# EAGLE design automatic temp control (EAGLE 9.6.2)
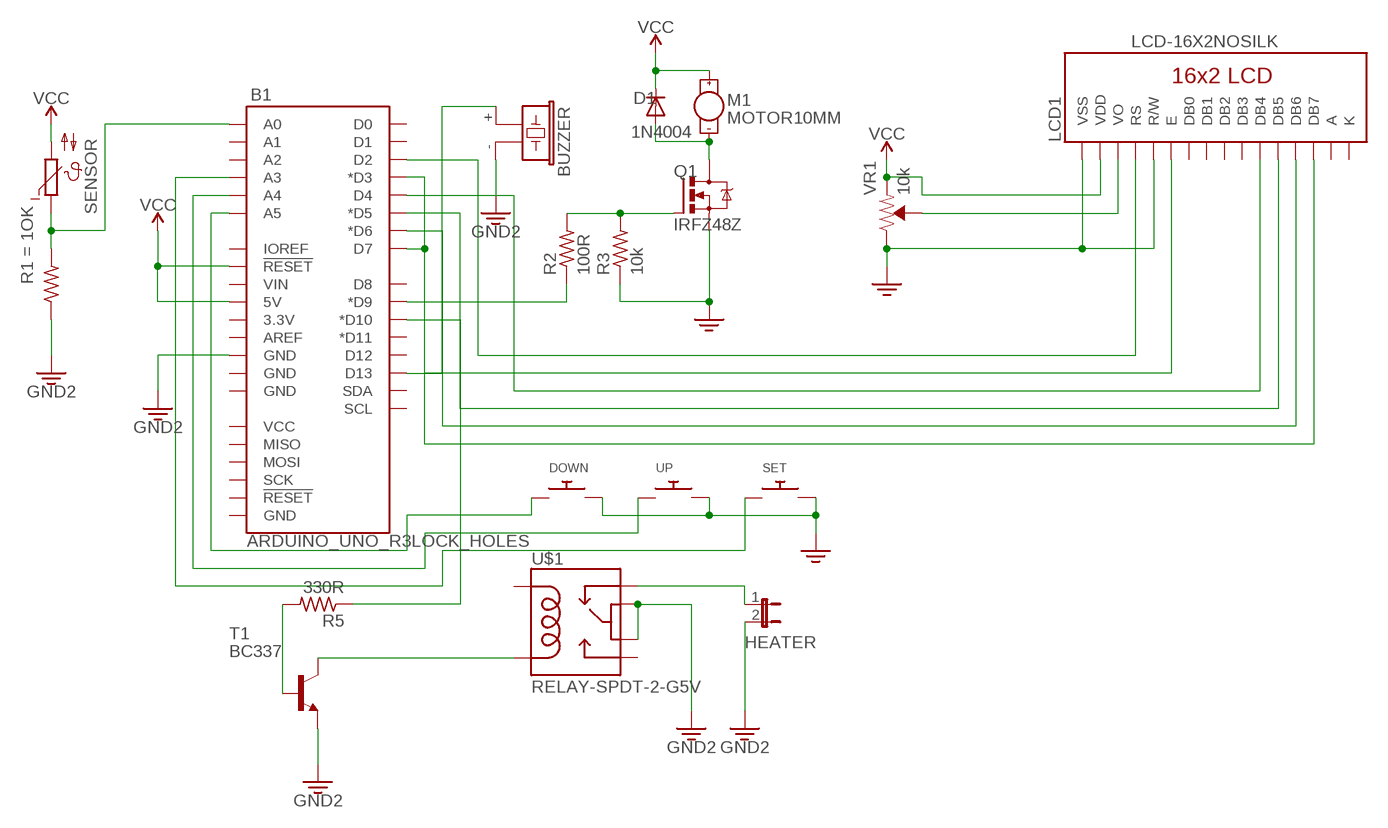
[diagram p0: schematic, sheet 1]

## Parts
B1  ARDUINO_UNO_R3LOCK_HOLES  [ARDUINO_R3_LOCK_HOLES]
BUZZER  F/CM04P  [F/CM04P]
D1  1N4004  [DO41-10]
DOWN  SWITCH_PUSHBUTTONEVQ-PE  [TACT_PANA-EVQ]
HEATER  JP1E  [JP1]
LCD1  LCD-16X2NOSILK  [LCD-16X2_NOSILK]
M1  MOTOR10MM  [VIBE-MOTOR-10MM]
Q1  IRFZ48Z  [TO220BH]
R2  100R  R-US_0204/7  [0204/7]
R3  10k  R-US_0204/7  [0204/7]
R4  R-US_0204/7  [0204/7]
R5  330R  R-US_0204/7  [0204/7]
SENSOR  NTC640-9  [N640]
SET  SWITCH_PUSHBUTTONEVQ-PE  [TACT_PANA-EVQ]
T1  BC337  [TO92]
U$1  RELAY-SPDT-2-G5V  [RELAY-G5V]
UP  SWITCH_PUSHBUTTONEVQ-PE  [TACT_PANA-EVQ]
VR1  10k  TRIMPOT-PTH-10MM-KNOB-1/2W-10%  [TRIMPOT-PTH-3386U]

## Nets
3.3V: B1.GND@4(GND) BUZZER.- DOWN.P$2 HEATER.2 LCD1.1(VSS) LCD1.5(R/W) Q1.S R3.1 R4.1 SET.P$2 T1.1(E) U$1.5 U$1.6 UP.P$2 VR1.3(CW) ; supply symbol labelled GND2
N$1: B1.A0 R4.2 SENSOR.1
N$2: B1.D10(*D10) R5.1
N$3: R5.2 T1.2(B)
N$4: T1.3(C) U$1.9
N$5: HEATER.1 U$1.1
N$6: B1.D13 BUZZER.+
N$7: B1.D9(*D9) R2.1
N$8: Q1.G R2.2 R3.2
N$9: D1.A M1.- Q1.D
N$10: B1.A5 DOWN.P$1
N$11: B1.A4 UP.P$1
N$12: LCD1.3(VO) VR1.2(WIPER)
N$13: B1.A3 SET.P$1
N$15: B1.D4 LCD1.11(DB4)
N$16: B1.D2 LCD1.4(RS)
N$17: B1.D5(*D5) LCD1.12(DB5)
N$18: B1.D6(*D6) LCD1.13(DB6)
N$19: B1.D3(*D3) B1.D7 LCD1.6(E) LCD1.14(DB7)
VCC: B1.5V B1.RESET@1(!RESET!) D1.C LCD1.2(VDD) M1.+ SENSOR.2 VR1.1(CCW)
Unconnected: B1.3.3V B1.A1 B1.A2 B1.AREF B1.D0 B1.D1 B1.D8 B1.D11(*D11) B1.D12 B1.GND@1(GND) B1.GND@2(GND) B1.GND@3(GND) B1.IOREF B1.MISO B1.MOSI B1.RESET@2(!RESET!) B1.SCK B1.SCL B1.SDA B1.VCC B1.VIN LCD1.7(DB0) LCD1.8(DB1) LCD1.9(DB2) LCD1.10(DB3) U$1.2 U$1.10

## Power pins joined to a net without a drawn wire
A: LCD1.15(A)
K: LCD1.16(K)

## Library data of the parts
B1 = SparkFun-Boards:ARDUINO_UNO_R3: Arduino R3 Footprint with SPI header Arduino Uno R3 Compatible Footprint. Matches PCB size of the original board. SparkFun Products: SAMD21 Dev Breakout <https://www.sparkfun.com/products/13672> RedBoard <https://www.sparkfun.com/products/12757> R3 Stackable Headers <https://www.sparkfun.com/products/11417>
BUZZER = buzzer:F/CM04P: BUZZER Source: Buerklin; OC_FARNELL: unknown; OC_NEWARK: unknown
D1 = adafruit:1N4004: DIODE General purpose 1N400x type rectifier (With bigger pads) http://www.ladyada.net/library/pcb/eaglelibrary.html
DOWN SET UP = adafruit:SWITCH_PUSHBUTTON: Buttons SOFTTOUCHSMD_SJ - Soft touch temporary push button (Super Junk Akihabara) Compatible with SKPMANE010 [Mouser: 688-SKPMAN] C&K_KSS = Digikey: KSS221GLFS
HEATER = jumper:JP1E: JUMPER
LCD1 = SparkFun-Displays:LCD-16X2: Standard text-only 16x2 parallel input LCD Basic 16 character by 2 line display. Typically utilizes the extremely common HD44780 parallel interface chipset SparkFun Products: Basic 16x2 Green <https://www.sparkfun.com/products/255> Basic 8x2 Green <https://www.sparkfun.com/products/11122>; SF_ID: LCD-00255
M1 = SparkFun-Electromechanical:MOTOR: Motor (Single-Phase) Two-terminal, single-phase motors. SparkFun Products Vibration Motor <https://www.sparkfun.com/products/8449> (ROB-08449) Physical dimension and wire connections for this powerful vibration motor. Motor has a self adhesive backing.; PROD_ID: COMP-08572; SF_SKU: ROB-08449
Q1 = transistor-power:IRFZ48: N Channel HEXFET® Power MOSFET Logic Level Source: http://www.irf.com/product-info/datasheets/data/irfz48z.pdf
R2 R3 R5 = rcl:R-US_: RESISTOR, American symbol; SPICEPREFIX: R
R4 = rcl:R-US_: RESISTOR, American symbol; R1: 1OK; SPICEPREFIX: R
SENSOR = ptc-ntc:NTC640-9: PHILIPS NTC; OC_FARNELL: unknown; OC_NEWARK: unknown
T1 = transistor:BC337: NPN TRANSISTOR
U$1 = SparkFun-Retired:RELAY-SPDT-2: SPDT Relay w/ Two Common Terminals SPDT relay (COM-00100); SF_SKU: COM-00524
VR1 = SparkFun-Resistors:TRIMPOT: Trimming Potentiometer (Trimpot) Three-terminal potentiometers, with an adjustable wiper and two adjustable resistors. A pot can be used to create a configurable voltage divider, or as a variable resistor. "Trimpots" are a subset of potentiometers, usually intended for "set-and-forget" applications. They're often more delicate than standard potentiometers - rated for fewer turns. Variants PTH-KNOB - PTH Trimpot w/ finger-adjustable knob Trimpot 10K with Knob <https://www.sparkfun.com/products/9806> (COM-09806) Datasheet <http://www.sparkfun.com/datasheets/Components/General/TSR-3386.pdf> SMD-3MM-CLOSED-FRAME - SMD 3mm Square Closed-Frame Trimpot Used on e.g. EasyDriver - Stepper Motor Driver <https://www.sparkfun.com/products/12779> Datasheet <http://www.bitechnologies.com/pdfs/22.pdf> (22AR10KTR) SMD-5MM - SMD 5mm Square Closed-Frame Trimpot Used on e.g. IOIO-OTG - V2.2 <https://www.sparkfun.com/products/13613> Datasheet <http://www.vishay.com/docs/51008/ts53.pdf> (TS53YL502MR10) SMD-3MM-1/10W-25% - 3mm Square Open-Frame Trimpot Used on e.g. SparkFun Shapeoko <https://www.sparkfun.com/products/13899> Datasheet <http://www.bourns.com/docs/Product-Datasheets/TC33.pdf> (TC33X-2-103E); PROD_ID: RES-09730; SF_SKU: COM-09806

## Board
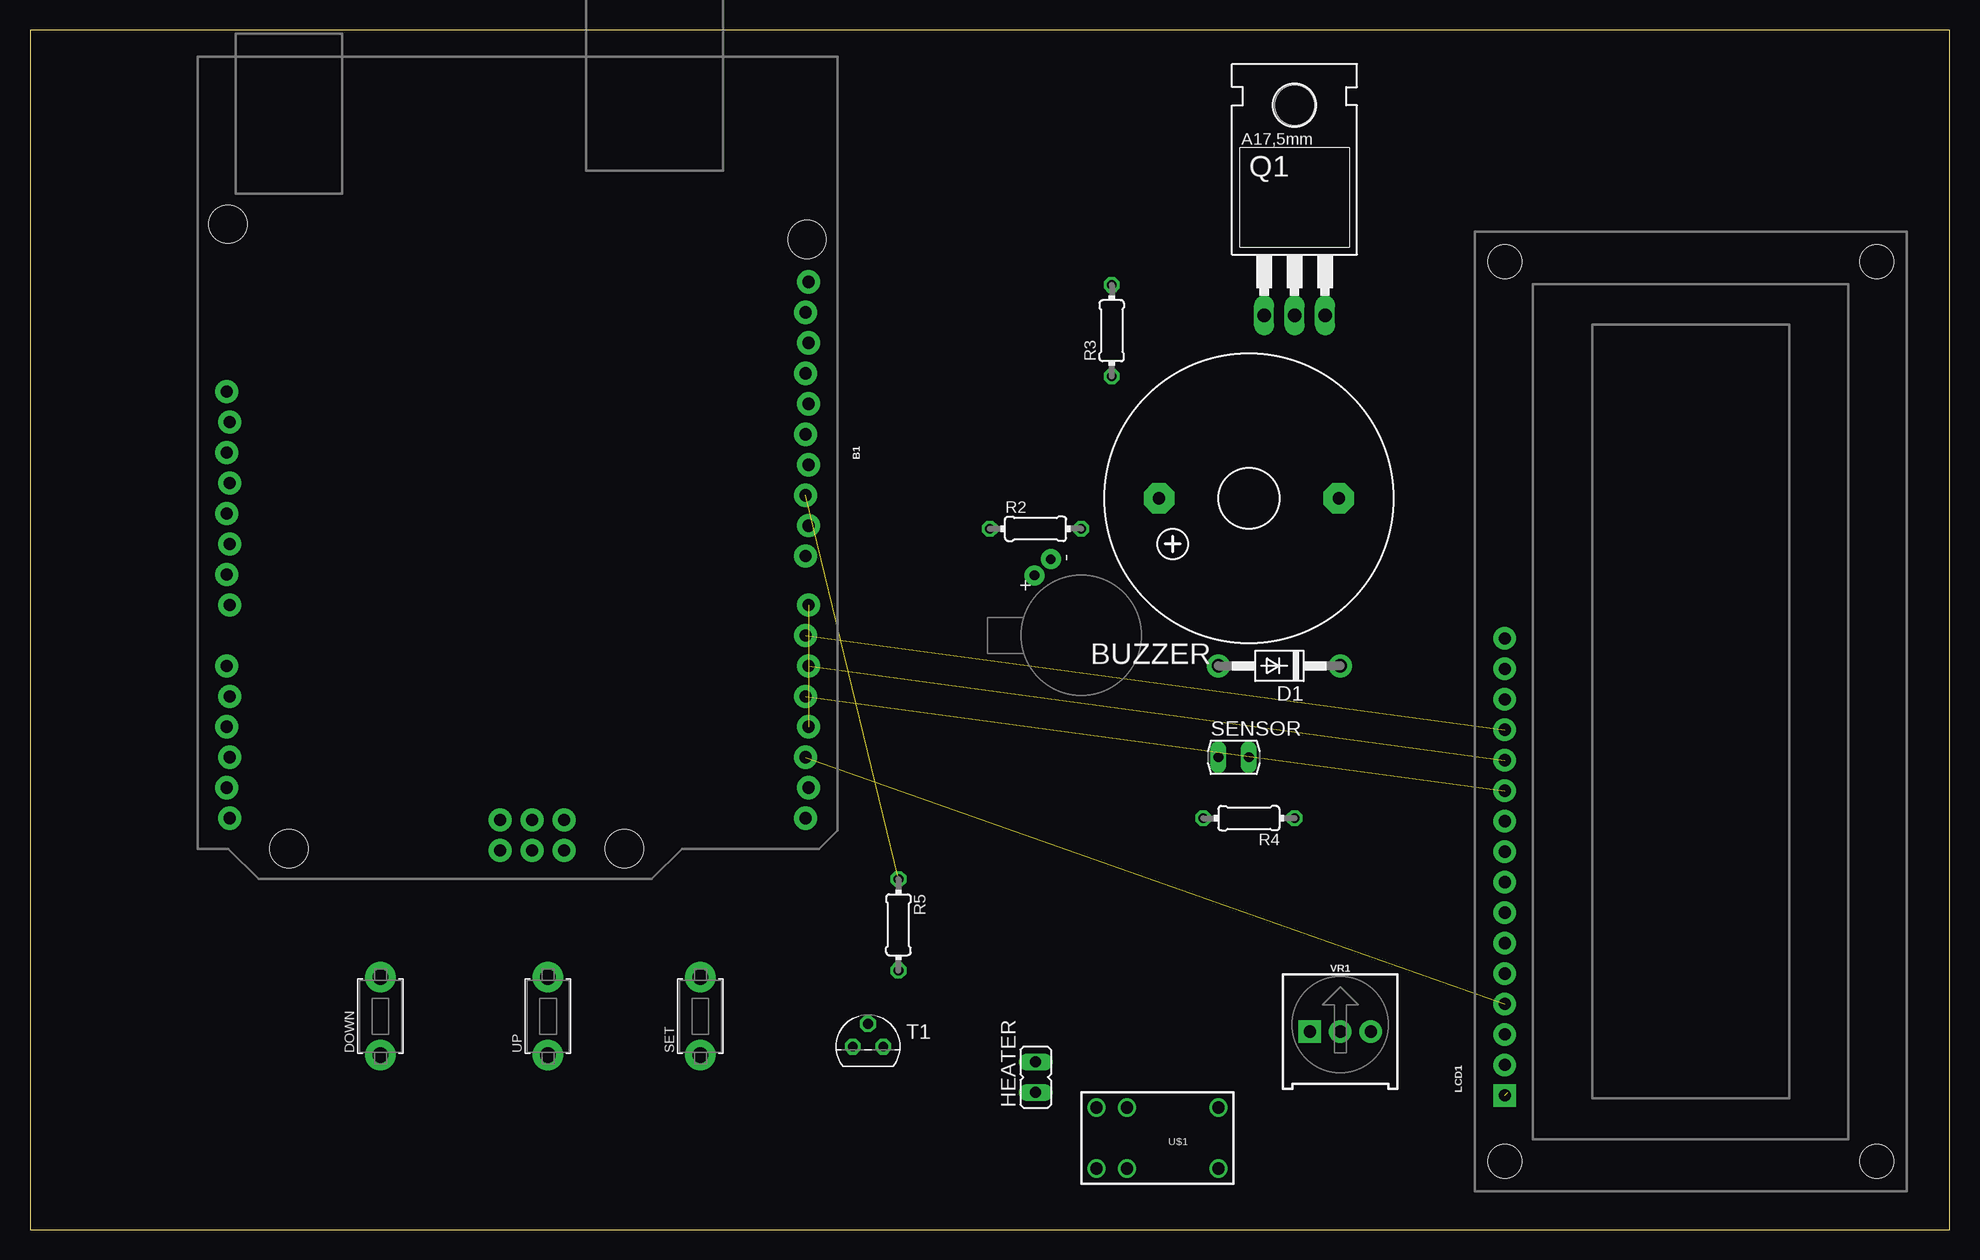
[diagram p1: board, top side]
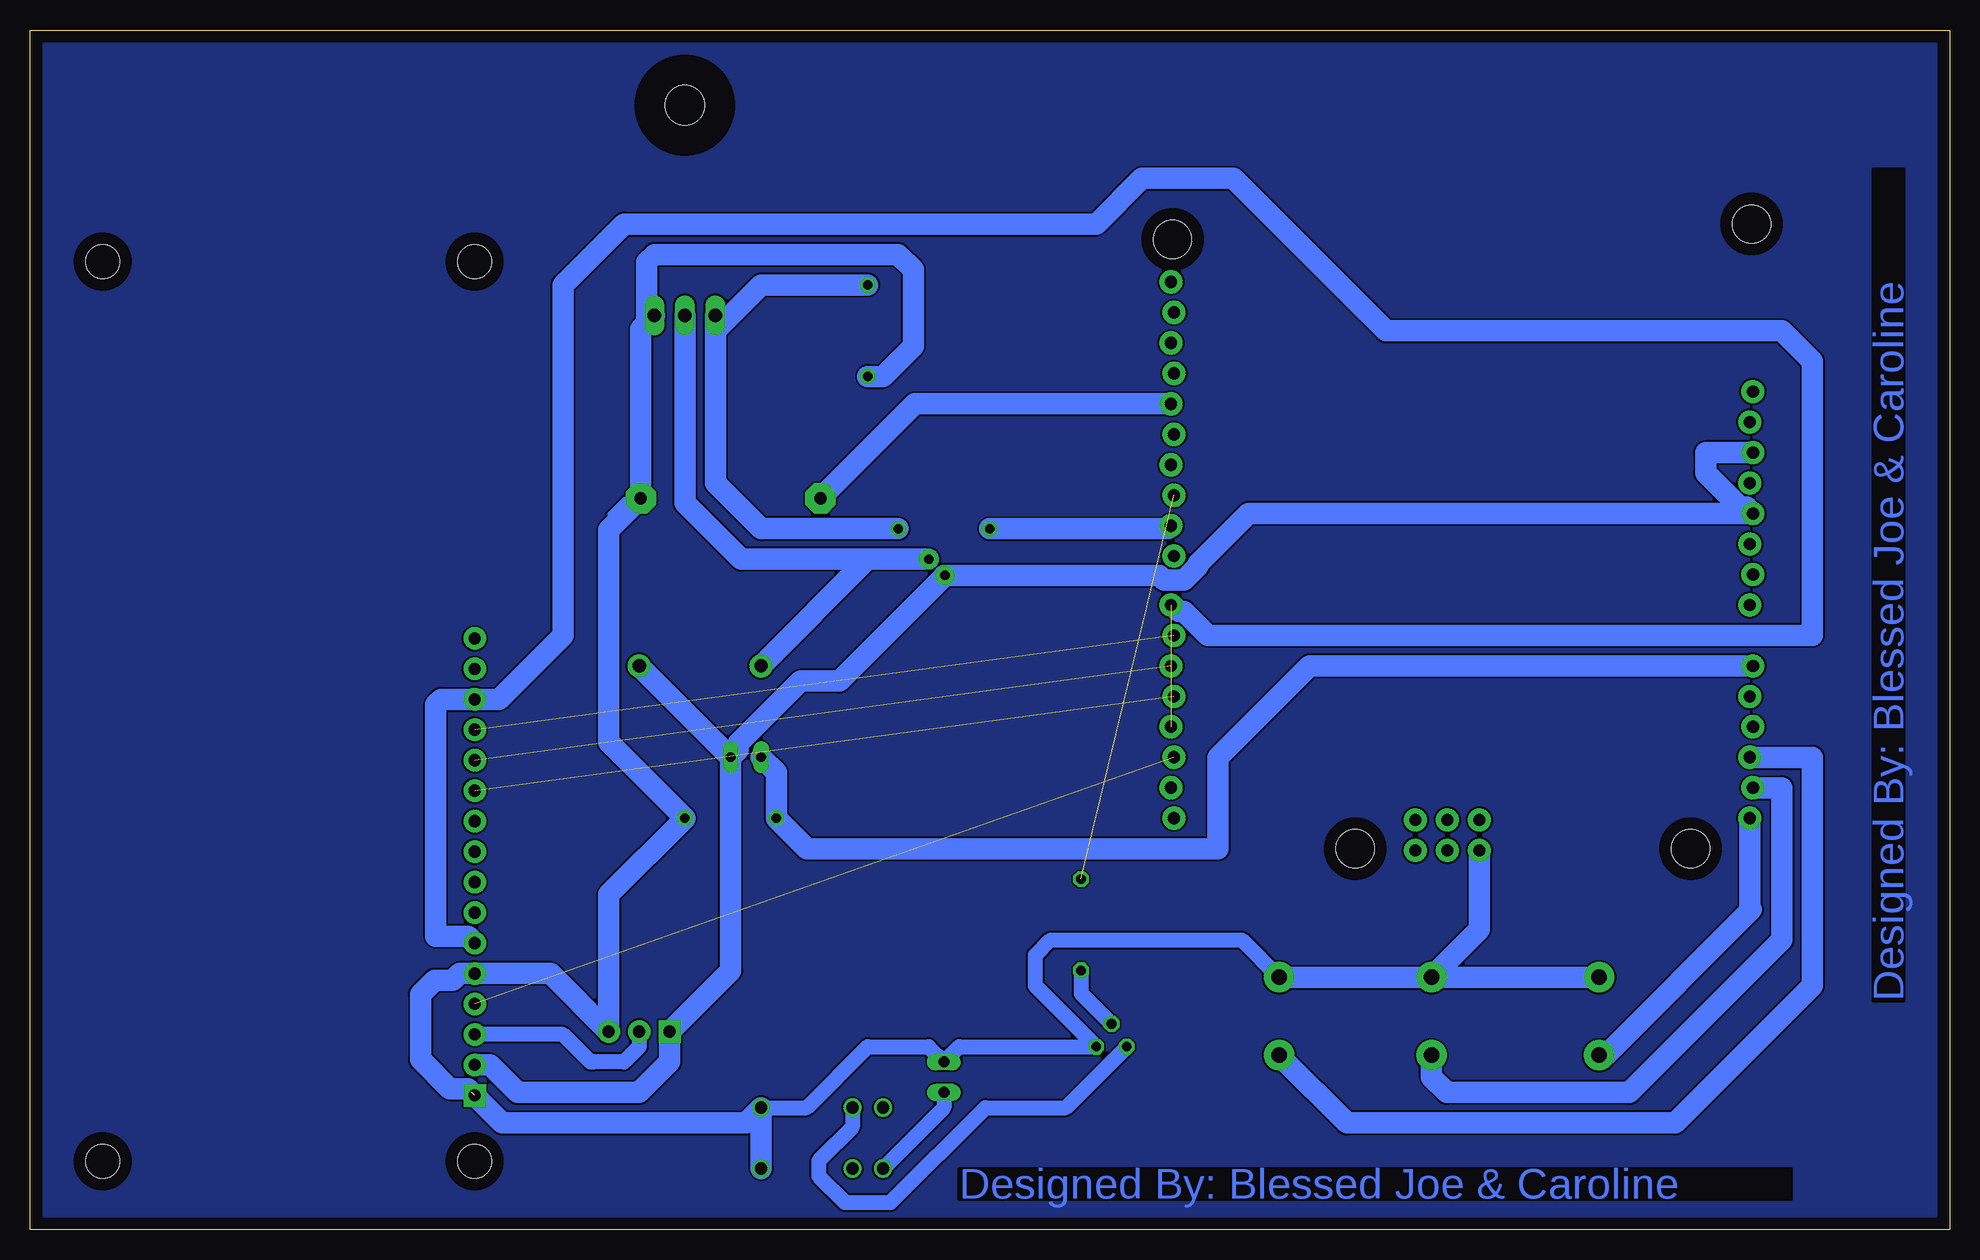
[diagram p2: board, bottom side, seen from below]

Size 160 x 100 mm. Coordinates in mm from the lower left corner, seen from the top.
Outline: 0,0 160,0 160,100 0,100 0,0
Copper layers (1*16): Top 0.035mm / dielectric 1.5mm / Bottom 0.035mm
Design rules "default": minimum track width 6mil, minimum drill 0.35mm, track to track 6mil, track to pad 6mil, pad to pad 6mil, via to via 6mil, smd to smd 6mil, copper to edge 40mil, drill to drill 6mil, minimum pad ring 10mil, minimum via ring 8mil, stop-mask expansion 4mil, vias tented up to drill 0mil, thermal gap 10mil

### Footprints (pad centres in the part's own frame; a part is rotated, then mirrored left to right if it is on the bottom)
ARDUINO_R3_LOCK_HOLES = drill 1.016 pad 1.93: 3.3V 35.56,2.667; 5V 38.1,2.413; A0 50.8,2.413; A1 53.34,2.667; A2 55.88,2.413; A3 58.42,2.667; A4 60.96,2.413; A5 63.5,2.667; AREF 23.876,50.927; D0 63.5,50.673; D1 60.96,50.927; D2 58.42,50.673; D3 55.88,50.927; D4 53.34,50.673; D5 50.8,50.927; D6 48.26,50.673; D7 45.72,50.927; D8 41.656,50.673; D9 39.116,50.927; D10 36.576,50.673; D11 34.036,50.927; D12 31.496,50.673; D13 28.956,50.927; GND@1 40.64,2.667; GND@2 43.18,2.413; GND@3 26.416,50.673; GND@4 66.18,25.223; IOREF 30.48,2.667; MISO 63.64,30.557; MOSI 66.18,27.89; NC 27.94,2.413; RESET@1 33.02,2.413; RESET@2 63.64,25.223; SCK 63.64,27.89; SCL 18.796,50.927; SDA 21.336,50.673; VCC 66.18,30.557; VIN 45.72,2.667 | hole 3.175: 15.24,50.8; 66.04,35.56; 66.04,7.62; 13.97,2.54
F/CM04P = drill 1.016 pad 2.54 octagon: + 7.493,0; - -7.493,0
DO41-10 = drill 1.118 pad 1.93: A 5.08,0; C -5.08,0
TACT_PANA-EVQ = drill 1.3 pad 2.54: P$1 -3.25,0; P$2 3.25,0
JP1 = drill 0.914 long: 1 0,-1.27; 2 0,1.27
LCD-16X2_NOSILK = drill 1.016 pad 1.88 square: 1 -32,15.5 | drill 1.016 pad 1.88: 2 -29.46,15.5; 3 -26.92,15.5; 4 -24.38,15.5; 5 -21.84,15.5; 6 -19.3,15.5; 7 -16.76,15.5; 8 -14.22,15.5; 9 -11.68,15.5; 10 -9.14,15.5; 11 -6.6,15.5; 12 -4.06,15.5; 13 -1.52,15.5; 14 1.02,15.5; 15 3.56,15.5; 16 6.1,15.5 | hole 2.8: -37.5,15.5; -37.5,-15.5; 37.5,15.5; 37.5,-15.5
VIBE-MOTOR-10MM = drill 0.8 pad 1.676: + -5,-3.9; - -6.35,-2.54
TO220BH = drill 1.118 long: D 0,-6.35; G -2.54,-6.35; S 2.54,-6.35 | hole 3.302: 0,11.176
0204/7 = drill 0.813 octagon: 1 -3.81,0; 2 3.81,0
N640 = drill 0.813 long: 1 -1.27,0; 2 1.27,0
TO92 = drill 0.813 octagon: 1 1.27,0; 2 0,1.905; 3 -1.27,0
RELAY-G5V = drill 1.016: 1 5.08,2.54; 2 2.54,2.54; 5 -5.08,2.54; 6 -5.08,-2.54; 9 2.54,-2.54; 10 5.08,-2.54
TRIMPOT-PTH-3386U = drill 1.016 pad 1.88 square: 1 -2.54,-0.015 | drill 1.016 pad 1.88: 2 0,-0.015; 3 2.54,-0.015

### Placement (x,y rotation side)
B1  13.97,97.79 270 top
BUZZER  101.6,60.96 180 top
D1  104.14,46.99 180 top
DOWN  29.21,17.78 90 top
HEATER  83.82,12.7 0 top
LCD1  138.43,43.18 90 top
M1  87.63,49.53 270 top
Q1  105.41,82.55 0 top
R2  83.82,58.42 0 top
R3  90.17,74.93 90 top
R4  101.6,34.29 180 top
R5  72.39,25.4 270 top
SENSOR  100.33,39.37 0 top
SET  55.88,17.78 90 top
T1  69.85,15.24 0 top
U$1  93.98,7.62 180 top
UP  43.18,17.78 90 top
VR1  109.22,16.51 0 top

### Tracks (layer width: path | path; a pad name or v marks a point on that pad's centre or on a via)
3.3V  (1 unrouted)
  Bottom 0.254: 107.95,81.28 Q1.S 108.58,75.56 109.22,74.93 109.22,60.96 | 109.22,60.96 BUZZER.- | 111.76,40.64 111.76,59.69 110.49,60.96 109.22,60.96 | 123.44,21.34 123.19,21.34 LCD1.5 116.61,21.34 VR1.3 | 123.19,11.44 LCD1.1
  Bottom 1.27: U$1.6 95.25,10.16 90.17,15.24 85.09,15.24 HEATER.2 82.55,15.24 T1.1 76.2,20.32 76.2,22.86 74.93,24.13 58.98,24.13 SET.P$2
  Bottom 1.778: VR1.3 111.77,27.93 R4.1 111.76,40.64 111.76,58.29 BUZZER.- 109.09,75.06 Q1.S | VR1.3 116.61,21.34 123.19,21.34 | U$1.5 U$1.6 100.33,8.89 120.64,8.89 123.19,11.44 | 123.19,11.43 123.5,11.74 125.02,11.74 127.45,14.17 127.45,19.62 126.29,20.78 124.76,20.78 124.2,21.34 LCD1.5 | SET.P$2 UP.P$2 | UP.P$2 DOWN.P$2 | B1.GND@4 39.19,25.02 UP.P$2 | R3.1 88.9,71.12 86.36,73.66 86.36,80.01 87.63,81.28 107.95,81.28 108.58,80.64 108.58,75.56
GND
  pour Bottom: 0,0 160.02,0 160.02,99.06 0,99.06
N$1
  Bottom 1.778: B1.A0 53.34,46.99 60.96,39.37 60.96,31.75 95.25,31.75 R4.2 97.79,38.1 SENSOR.1
N$2  (1 unrouted)
N$3
  Bottom 1.27: R5.2 72.39,19.68 T1.2
N$4
  Bottom 1.27: T1.3 73.66,10.16 80.36,10.16 88.26,2.26 92.08,2.26 94.26,4.44 94.26,5.72 91.44,8.54 U$1.9
N$5
  Bottom 1.27: HEATER.1 83.82,10.16 U$1.1
N$6
  Bottom 1.778: BUZZER.+ 86.23,68.83 B1.D13
N$7
  Bottom 1.778: R2.1 65.15,58.42 B1.D9
N$8
  Bottom 1.778: R2.2 99.06,58.42 102.87,62.23 102.87,74.93 | 102.87,74.93 Q1.G | R3.2 99.06,78.74 102.87,74.93
N$9
  Bottom 1.778: D1.A 90.17,55.88 M1.- 100.71,55.88 105.41,60.58 Q1.D
N$10
  Bottom 1.778: B1.A5 16.64,26.8 16.51,26.67 28.65,14.53 DOWN.P$1
N$11
  Bottom 1.778: B1.A4 13.97,36.83 13.97,24.13 26.67,11.43 41.91,11.43 43.18,12.7 UP.P$1
N$12
  Bottom 0.254: 115.57,16.26 115.32,16.26 113.03,13.97
  Bottom 1.27: VR1.2 109.22,15.24 110.49,13.97 113.03,13.97 113.28,13.97 115.57,16.26 LCD1.3
N$13
  Bottom 0.254: 55.6,14.25 SET.P$1
  Bottom 1.778: B1.A3 11.43,39.37 11.43,20.32 22.86,8.89 50.24,8.89 55.6,14.25
N$15  (1 unrouted)
  Bottom 0.203: LCD1.11 123.18,36.83 123.19,36.83
N$16  (1 unrouted)
N$17  (1 unrouted)
N$18  (1 unrouted)
N$19  (1 unrouted)
  Bottom 0.203: 68.58,86.36 71.12,83.82 | B1.D7 62.36,49.53 59.69,49.53 12.7,49.53
  Bottom 0.254: B1.D7 64.77,52.07 | 64.77,41.91 B1.D3 | 123.19,44.2 LCD1.14
  Bottom 1.778: LCD1.6 123.49,24.44 126.18,24.44 126.18,43.75 125.73,44.2 123.19,44.2 | LCD1.14 120.9,44.2 115.57,49.53 115.57,78.74 110.49,83.82 71.12,83.82 67.31,87.63 59.69,87.63 46.99,74.93 13.97,74.93 11.43,72.39 11.43,49.53 59.69,49.53 61.8,49.53 63.81,51.54 64.24,51.54 64.77,52.07
VCC
  Bottom 0.254: M1.+ 63.58,54.53 58.42,59.69 | 101.6,21.57 VR1.1 | VR1.1 | 106.67,13.98 VR1.1
  Bottom 1.778: B1.RESET@1 20.32,64.77 20.32,63.08 17.47,60.22 16.92,60.22 B1.5V 58.42,59.69 62.64,55.47 62.64,55.3 63.81,54.13 65.47,54.13 65.86,54.51 83.8,54.51 | M1.+ 92.54,45.72 95.78,45.72 100.99,40.51 100.99,39.98 SENSOR.2 | SENSOR.2 D1.C | LCD1.2 121.66,13.72 119.37,11.43 109.22,11.43 106.67,13.98 106.68,13.98 VR1.1 101.6,21.57 SENSOR.2

### Text on the board
Bottom: Designed By: Blessed Joe & Caroline | Designed By: Blessed Joe & Caroline